# Altium project partes_proyecto.PrjPcb
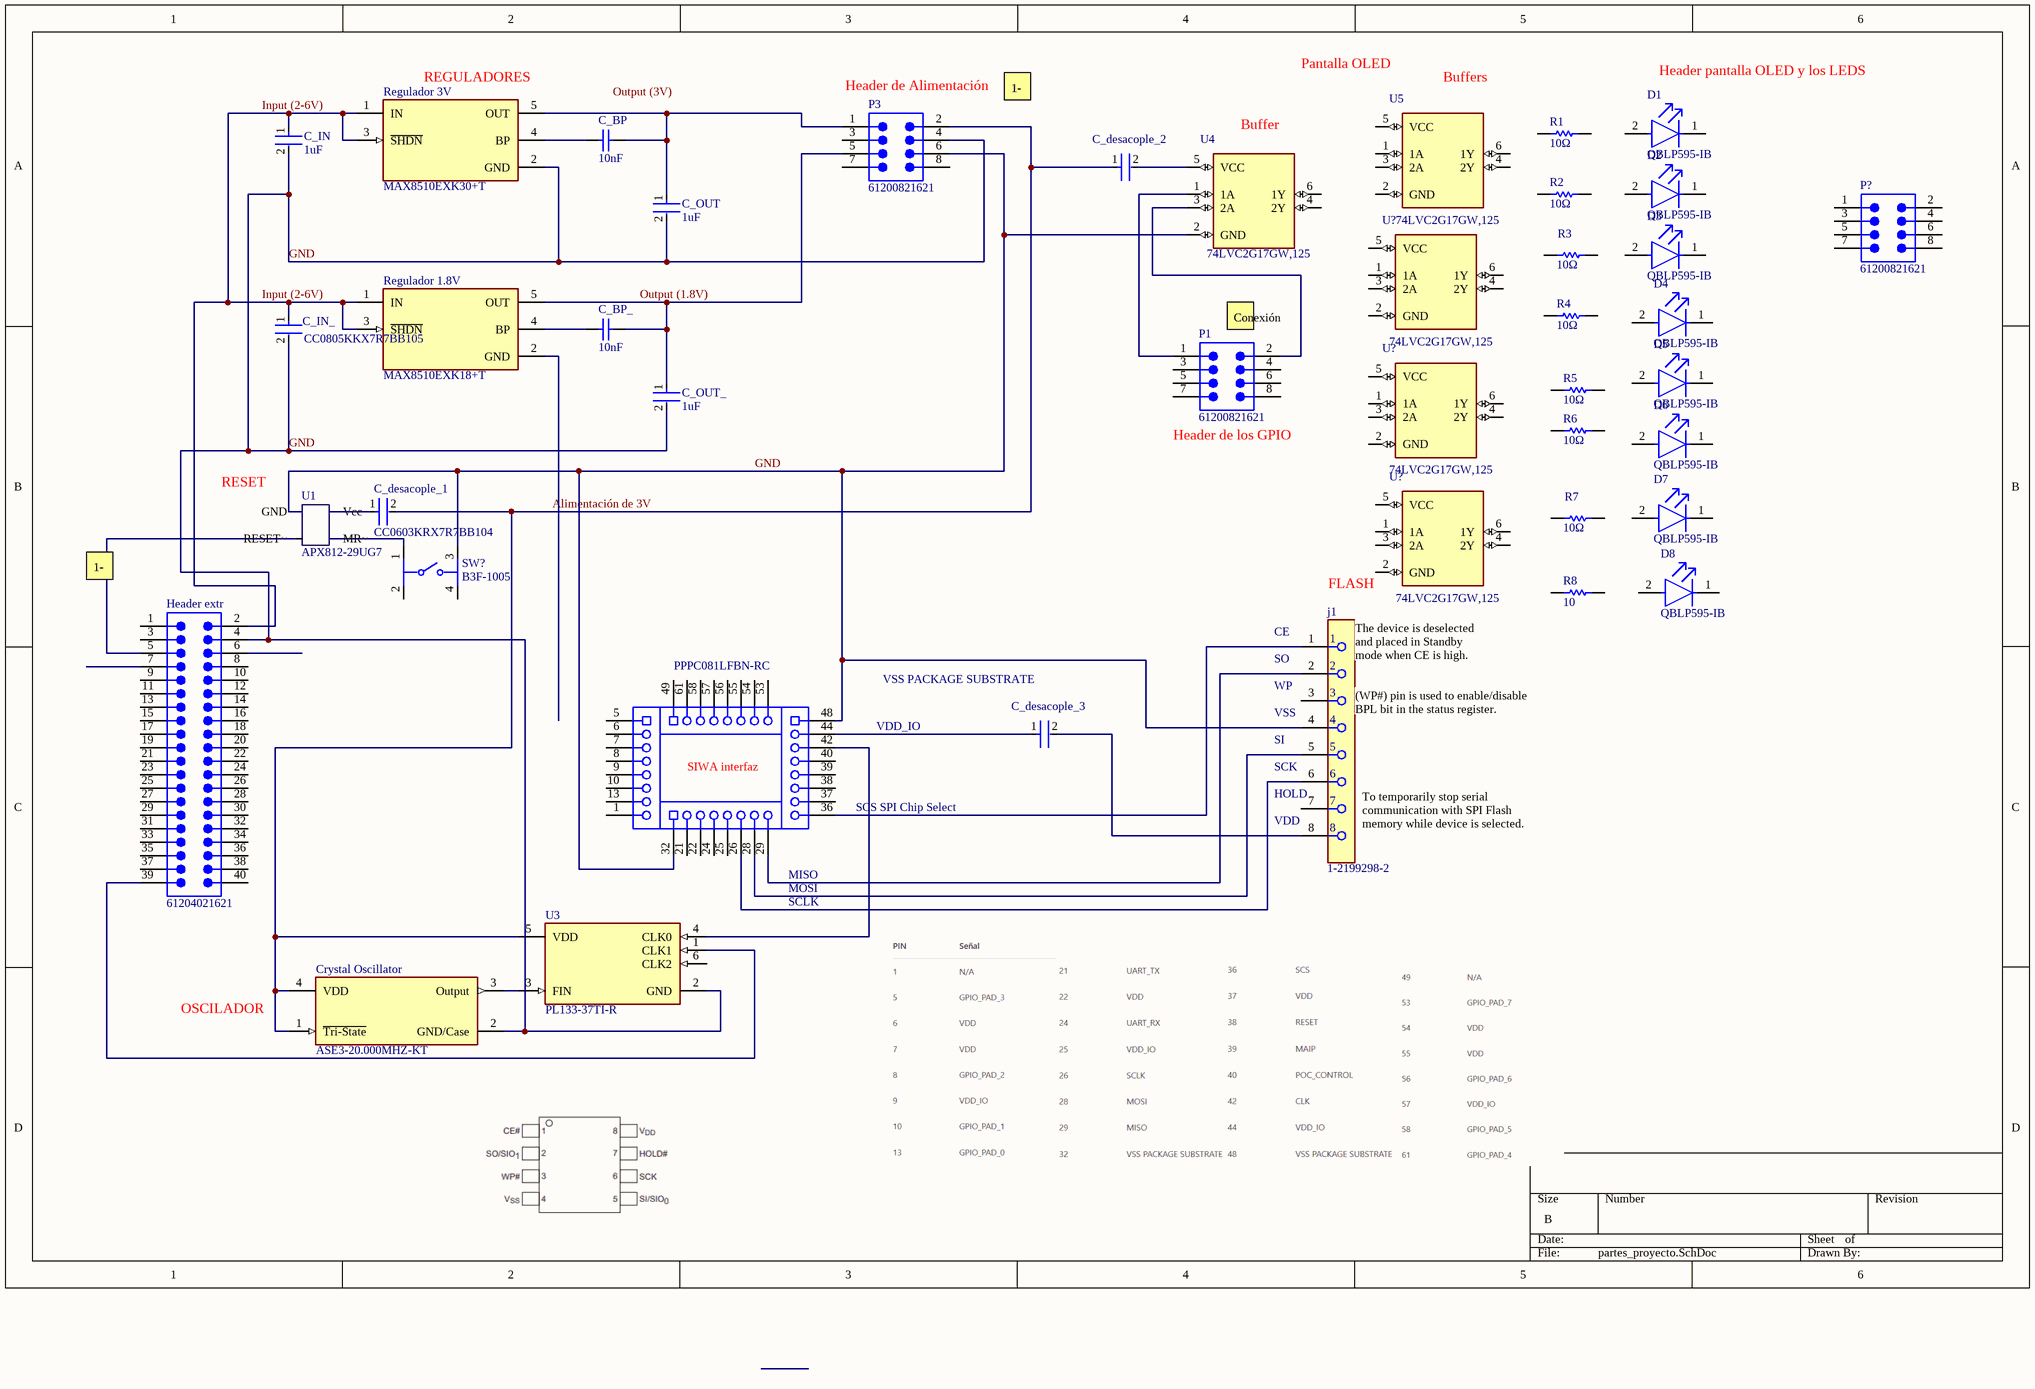
[diagram p0: partes_proyecto.SchDoc]
1 sheet, 45 parts. Net scope: global (net labels, ports and power ports of the same name join across sheets).

## Sheet partes_proyecto.SchDoc
size B; SheetNumber: 1; SheetTotal: 1

### Parts
(Parts that share a designator on the sheet are numbered #1, #2 ... from top to bottom, then left to right.)
C_BP  10nF  [CAPC2013X100X50NL20T25]
C_BP_  10nF  [CAPC2013X100X50NL20T25]
C_desacople_1  CC0603KRX7R7BB104  [FP-CC0603-DA-MFG]
C_desacople_2  CC0603KRX7R7BB104  [FP-CC0603-DA-MFG]  (value not drawn)
C_desacople_3  CC0603KRX7R7BB104  [FP-CC0603-DA-MFG]  (value not drawn)
C_IN  1uF  [FP-CC0805-0_85-MFG]
C_IN_  CC0805KKX7R7BB105  [FP-CC0805-0_85-MFG]
C_OUT  1uF  [FP-CC0805-0_85-MFG]
C_OUT_  1uF  [FP-CC0805-0_85-MFG]
Crystal_Oscillator  ASE3-20.000MHZ-KT  [FP-ASE3-MFG]
D1  QBLP595-IB  [FP-QBLP595-IB-MFG]
D2  QBLP595-IB  [FP-QBLP595-IB-MFG]
D3  QBLP595-IB  [FP-QBLP595-IB-MFG]
D4  QBLP595-IB  [FP-QBLP595-IB-MFG]
D5  QBLP595-IB  [FP-QBLP595-IB-MFG]
D6  QBLP595-IB  [FP-QBLP595-IB-MFG]
D7  QBLP595-IB  [FP-QBLP595-IB-MFG]
D8  QBLP595-IB  [FP-QBLP595-IB-MFG]
Header_extr  61204021621  [61204021621]
j1  1-2199298-2  [FP-1-2199298-2-MFG]
P1  61200821621  [61200821621]
P3  61200821621  [61200821621]
P?  61200821621  [61200821621]
R1  value 10Ω  (hidden comment: Resistor)
R2  value 10Ω  (hidden comment: Resistor)
R3  value 10Ω  (hidden comment: Resistor)
R4  value 10Ω  (hidden comment: Resistor)
R5  value 10Ω  (hidden comment: Resistor)
R6  value 10Ω  (hidden comment: Resistor)
R7  value 10Ω  (hidden comment: Resistor)
R8  value 10  (hidden comment: Resistor)
Regulador_1.8V  MAX8510EXK18+T  [FP-X5-1-MFG]
Regulador_3V  MAX8510EXK30+T  [FP-X5-1-MFG]
siwa1  PPPC081LFBN-RC  [SLIN-PPPC081LFBN-RC_V]  (value not drawn)
siwa2  PPPC081LFBN-RC  [SLIN-PPPC081LFBN-RC_V]  (value not drawn)
siwa3  PPPC081LFBN-RC  [SLIN-PPPC081LFBN-RC_V]  (value not drawn)
siwa4  PPPC081LFBN-RC  [SLIN-PPPC081LFBN-RC_V]  (value not drawn)
SW?  B3F-1005  [FP-B3F-1005-MFG]
U1  APX812-29UG7  [APX812-29UG7]
U3  PL133-37TI-R  [FP-SOT23-6LD-PL-1-IPC_A]
U4  74LVC2G17GW,125  [SOT363_INFINEON]
U5  74LVC2G17GW,125  [SOT363_INFINEON]
U?#1  74LVC2G17GW,125  [SOT363_INFINEON]
U?#2  74LVC2G17GW,125  [SOT363_INFINEON]
U?#3  74LVC2G17GW,125  [SOT363_INFINEON]

### Nets
Alimentación de 3V: C_desacople_1.2 C_desacople_2.1 Crystal_Oscillator.1(~{Tri-State}) Crystal_Oscillator.4(VDD) P3.2 U3.5(VDD)
GND: C_IN.2 C_IN_.2 C_OUT.2 C_OUT_.2 Crystal_Oscillator.2(GND/Case) Header_extr.4 j1.4 P3.4 P3.6 Regulador_3V.2(GND) siwa3.48 siwa4.32 SW?.3 U1.GND U3.2(GND) U4.2(GND)
Input (2-6V): C_IN.1 C_IN_.1 Header_extr.2 Regulador_1.8V.1(IN) Regulador_1.8V.3(~{SHDN}) Regulador_3V.1(IN) Regulador_3V.3(~{SHDN})
Output (1.8V): C_BP_.2 C_OUT_.1 P3.5 Regulador_1.8V.5(OUT)
NetC_BP_1: C_BP.1 Regulador_3V.4(BP)
NetC_BP_2: C_BP.2 C_OUT.1 P3.1 Regulador_3V.5(OUT)
NetC_BP__1: C_BP_.1 Regulador_1.8V.4(BP)
NetC_desacople_1_1: C_desacople_1.1 U1.0(Vcc)
NetC_desacople_2_2: C_desacople_2.2 U4.5(VCC)
NetC_desacople_3_1: C_desacople_3.1 siwa3.44
NetC_desacople_3_2: C_desacople_3.2 j1.8
NetCrystal_Oscillator_3: Crystal_Oscillator.3(Output) U3.3(FIN)
NetHeader_extr_39: Header_extr.39 U3.1(CLK1)
Netj1_1: j1.1 siwa3.36
Netj1_2: j1.2 siwa4.29
Netj1_5: j1.5 siwa4.28
Netj1_6: j1.6 siwa4.26
NetP1_1: P1.1 U4.1(1A)
NetP1_2: P1.2 U4.3(2A)
Netsiwa3_42: siwa3.42 U3.4(CLK0)
NetSW?_1: SW?.1 U1.3(MR~)

Not connected (* = marked no-connect by the designer): D1 1(C) 2(A); D2 1(C) 2(A); D3 1(C) 2(A); D4 1(C) 2(A); D5 1(C) 2(A); D6 1(C) 2(A); D7 1(C) 2(A); D8 1(C) 2(A); Header_extr 1 3 5 6 7 8 9 10 11 12 13 14 15 16 17 18 19 20 21 22 23 24 25 26 27 28 29 30 31 32 33 34 35 36 37 38 40; j1 3 7; P1 3 4 5 6 7 8; P3 3 7 8; P? 1 2 3 4 5 6 7 8; R1 1 2; R2 1 2; R3 1 2; R4 1 2; R5 1 2; R6 1 2; R7 1 2; R8 1 2; Regulador_1.8V 2(GND); siwa1 1(8) 5(1) 6(2) 7(3) 8(4) 9(5) 10(6) 13(7); siwa2 49(1) 53(8) 54(7) 55(6) 56(5) 57(4) 58(3) 61(2); siwa3 37(7) 38(6) 39(5) 40(4); siwa4 21(2) 22(3) 24(4) 25(5); SW? 2 4; U1 2(RESET~); U3 6(CLK2); U4 4(2Y) 6(1Y); U5 1(1A) 2(GND) 3(2A) 4(2Y) 5(VCC) 6(1Y); U?#1 1(1A) 2(GND) 3(2A) 4(2Y) 5(VCC) 6(1Y); U?#2 1(1A) 2(GND) 3(2A) 4(2Y) 5(VCC) 6(1Y); U?#3 1(1A) 2(GND) 3(2A) 4(2Y) 5(VCC) 6(1Y)

### Notes on the sheet
- (near Regulador_3V) REGULADORES
- (near P3) Header de Alimentación
- 1- Regulador de 3V
  3- Alimentación externa de 3V
  5- Regulador de 5V
  7- Alimentación externa de 1.8V
  2- Salida de 3V
  4- Entrada de GND de los reguladores
  6- Salida de GND para el resto del circuito
  8- Salida de 1.8V
- Pantalla OLED
- (near U5) Buffers
- Header pantalla OLED y los LEDS
- (near U4) 1A- GPIO 0
  2A- GPIO 1
- (near U4) Buffer
- (near P1) Conexión de los GPIO [0-7] en los puertos, desde el [1-8]
- (near U1) RESET
- (near P1) Header de los GPIO
- 1- Alimentación externa
  3- Tierra externa
  5- Reset generado con pulsador en la PCB
  7- Reset externo
  2- Alimentación que va a reguladores
  4- Tierra que va a reguladores
  6- Salida del Reset que va a SIWA
  8-
- (near j1) CE
- FLASH
- (near siwa2) PPPC081LFBN-RC
- VSS PACKAGE SUBSTRATE
- (near j1) SO
- (near j1) WP
- (near j1) The device is deselected and placed in Standby mode when CE is high.
- SIWA interfaz
- VDD_IO
- (near j1) VSS
- (near j1) SI
- (near j1) SCK
- (near j1) (WP#) pin is used to enable/disable BPL bit in the status register.
- (near siwa3) SCS SPI Chip Select
- (near j1) HOLD
- (near j1) VDD
- (near j1) To temporarily stop serial communication with SPI Flash memory while device is selected.
- MISO
- MOSI
- SCLK
- OSCILADOR
- Labels drawn without touching a wire or pin: Output (3V)

### Library data of the parts
C_BP C_BP_ = CMP-2007-03708-1: Part Number: C0805F103K5RACTU; Manufacturer: Kemet
C_desacople_1-C_desacople_3 = CMP-2000-05002-2: CAP CER 0.1UF 16V X7R 0603; Manufacturer: YAGEO; Tolerance: 0.1; Value: 100 nF; Temperature Coefficient: 15%; Voltage Rating: 16 V; Package: CC0603-DA; ComponentLink2Description: Datasheet; Octopart: https://octopart.com/cc0603krx7r7bb104-yageo-192941; Temperature Range High: +125°C; Digikey Description: CAP CER 0.1UF 16V X7R 0603; Voltage: 16 V; Device Class L2: Capacitors; Height: 0.9mm; Temperature: -55°C to +125°C; Manufacturer Part Number: CC0603KRX7R7BB104; Device Class L1: Passive Components; Device Class L3: Ceramic Capacitors; ComponentLink2URL: http://www.yageo.com/documents/recent/UPY-GPHC_X7R_6.3V-to-50V_18.pdf; Footprint Url: http://www.yageo.com/exep/pages/download/literatures/UPY-C_GEN_24.pdf; RoHS: TRUE; Temperature Range Low: -55°C; Temperature Characteristic: X7R; Lead Free: Yes; Capacitance: 100 nF; Category: Cap; Mouser Description: Multilayer Ceramic Capacitor, CC Series, 0.1 - F, - 10%, X7R, 16 V, 0603 [1608 Metric]; Material: Ceramic; Automotive: No
C_IN C_OUT C_OUT_ = CMP-03422-000001-1: CAP CER 1UF 16V X7R 0805; Manufacturer: Yageo; Manufacturer Part Number: CC0805KKX7R7BB105; Tolerance: 0.1; Voltage Rating: 16 V; Category: Cap; Capacitance: 1 uF; ComponentLink2Description: Datasheet; Automotive: No; Temperature Range High: +85°C; RoHS: TRUE; Footprint Url: http://www.yageo.com/exep/pages/download/literatures/UPY-C_GEN_24.pdf; Mouser Description: Multilayer Ceramic Capacitors MLCC - SMD/SMT 1.0uF 16V X7R 10%; Height: 0.95mm; Ipc Land Pattern Name: CAPC200125X85; Temperature: -30°C to +85°C; Lead Free: Yes; Value: 1 uF; Temperature Characteristic: X7R; Package: CC0805-0.85; Temperature Range Low: -30°C; Device Class L1: Passive Components; Device Class L3: Ceramic Capacitors; Octopart: https://octopart.com/cc0805kkx7r7bb105-yageo-8376555; Material: Ceramic; ComponentLink2URL: http://www.yageo.com/documents/recent/UPY-GPHC_Y5V_6.3V-to-50V_8.pdf; Device Class L2: Capacitors; Digikey Description: CAP CER 1UF 16V X7R 0805
C_IN_ = CMP-03422-000001-1: CAP CER 1UF 16V X7R 0805; Manufacturer: Yageo; Tolerance: 0.1; Voltage Rating: 16 V; Category: Cap; Capacitance: 1 uF; ComponentLink2Description: Datasheet; Automotive: No; Temperature Range High: +85°C; RoHS: TRUE; Footprint Url: http://www.yageo.com/exep/pages/download/literatures/UPY-C_GEN_24.pdf; Mouser Description: Multilayer Ceramic Capacitors MLCC - SMD/SMT 1.0uF 16V X7R 10%; Height: 0.95mm; Ipc Land Pattern Name: CAPC200125X85; Temperature: -30°C to +85°C; Lead Free: Yes; Value: 1 uF; Temperature Characteristic: X7R; Package: CC0805-0.85; Temperature Range Low: -30°C; Device Class L1: Passive Components; Device Class L3: Ceramic Capacitors; Octopart: https://octopart.com/cc0805kkx7r7bb105-yageo-8376555; Material: Ceramic; Manufacturer Part Number: CC0805KKX7R7BB105; ComponentLink2URL: http://www.yageo.com/documents/recent/UPY-GPHC_Y5V_6.3V-to-50V_8.pdf; Device Class L2: Capacitors; Digikey Description: CAP CER 1UF 16V X7R 0805
Crystal_Oscillator = CMP-27762-010045-1: XTAL OSC XO 20.0000MHZ CMOS SMD; Min Supply Voltage: 1.71V; Max Supply Current: 4mA; Operating Supply Voltage: 1.8V; Max Supply Voltage: 1.89V; Frequency: 20MHz; Frequency Stability: 30ppm; Load Capacitance: 15pF; Length: 3.2mm; Mount: Surface Mount; Min Operating Temperature: -10°C; Max Operating Temperature: 70°C; Series: ASE3; Height: 0.049inch; Package Quantity: 1000; Depth: 2.5mm; Case/Package: SMD/SMT; Number of Pins: 4; Lead Free: Lead Free; Width: 0.098inch; Termination: SMD/SMT; Packaging: Tape and Reel; Radiation Hardening: No
D1-D8 = CMP-113271-000002-1: LED BLUE CLEAR 0402 SMD; Lens Size: 0.5mm; Dominant Wavelength: 465nm; Forward Voltage: 3.1V; Lens Color: Colorless; Luminous Intensity: 85mcd; Test Current: 20mA; Viewing Angle: 140°; Lens Style: Flat; Width: 0.5mm; Case Code (Metric): 1005; Lens Transparency: Clear; Color: Blue; Packaging: Tape and Reel; Case Code (Imperial): 0402; Mount: Surface Mount; Length: 1mm; Case/Package: 0402; Height: 0.6mm
Header_extr = CMP-1502-00015-3: NexarPartId: 25903616; Gender: Male; Row Spacing: 2.54mm; Connector Type: Male Pin; Current Rating: 3A; Number of Positions: 40; Voltage Rating: 250V; Insulation Resistance: 1GΩ; Contact Resistance: 20mΩ; RoHS: Compliant; Color: Black; Pitch: 2.54mm; Orientation: Vertical; Contact Plating: Gold; Lead Pitch: 2.54mm; REACH SVHC: Unknown; Termination: Solder; Max Operating Temperature: 105°C; Insulation Material: PBT; Number of Rows: 2; Min Operating Temperature: -40°C; Number of Pins: 40; Mount: Through Hole; Contact Material: Copper; Number of Contacts: 40; Height: 9.25mm; Length: 58.46mm; Operating Supply Voltage: 250V
j1 = CMP-03370-000009-1: CONN IC DIP SOCKET 8POS TIN; Contact Post Length: 3inch; Number of Contacts: 8; Contact Current Rating: 1A; Contact Resistance: 20mR; Insulation Resistance: 1GR; Connector Type: Pin; Row Spacing: 0.3inch; Pitch: 2.54mm; Mating Alignment: Yes (With); RoHS Compliant: Yes; Packaging: Rail/Tube; Contact Material: Bronze; Lead Pitch: 2.54mm; Mount: Through Hole; Termination: Through Hole; Max Operating Temperature: 105°C; Flammability Rating: UL94 V-0; Package Quantity: 60; Contact Finish - Mating: TIN; ELV: Compliant; Radiation Hardening: No; Number of Rows: 2; Series: Diplomate DL; Color: Black; Number of Positions: 8; Contact Plating: Tin; Min Operating Temperature: -40°C; Lead Free: Lead Free; Length: 0.4inch; Orientation: Straight; Housing Material: PBT
P1 P3 P? = CMP-1502-00006-2: NexarPartId: 32855460; Gender: Male; Row Spacing: 2.54mm; Connector Type: Male Pin; Insulation Resistance: 1GΩ; Contact Resistance: 20mΩ; Number of Positions: 8; Current Rating: 3A; Operating Supply Voltage: 250V; Orientation: Vertical; Lead Pitch: 2.54mm; Length: 17.82mm; Max Operating Temperature: 105°C; Mount: Through Hole; Color: Black; Insulation Material: PBT; RoHS: Compliant; Contact Material: Copper; Number of Contacts: 8; Pitch: 2.54mm; Contact Plating: Gold; Min Operating Temperature: -40°C; Number of Pins: 8; Termination: Solder; REACH SVHC: Unknown; Number of Rows: 2
R1-R8 = Resistor: TC1: 0; SimulationGenericComponent: True; TC2: 0
Regulador_1.8V = CMP-0246-00401-2: IC REG LINEAR 1.8V 120MA SC70-5; Accuracy: 2%; Number of Outputs: 1; Min Current Limit: 130mA; Max Input Voltage: 6V; Max Power Dissipation: 247mW; Output Configuration: Positive; Output Type: Fixed; Quiescent Current: 90uA; Reference Voltage: 1.225V; Min Input Voltage: 2V; Power Supply Rejection Ratio (PSRR): 54dB; Input Bias Current: 40uA; Output Current: 120mA; Nominal Output Voltage: 1.8V; Output Voltage: 1.8V; Series: -; Number of Regulators: 1; Packaging: Tape and Reel; Mount: Surface Mount; Case/Package: SC; Lead Free: Lead Free; RoHS Compliant: Yes; Number of Pins: 5; Package Quantity: 2500; Max Output Current: 120mA; Polarity: Positive; Min Operating Temperature: -40°C; Max Operating Temperature: 85°C
Regulador_3V = CMP-0246-00520-2: IC REG LINEAR 3V 120MA SC70-5; Output Configuration: Positive; Dropout Voltage: 120mV; Min Current Limit: 130mA; Number of Outputs: 1; Max Input Voltage: 6V; Power Supply Rejection Ratio (PSRR): 54dB; Reference Voltage: 1.225V; Min Input Voltage: 2V; Max Power Dissipation: 247mW; Accuracy: 2%; Input Bias Current: 40uA; Output Type: Fixed; Quiescent Current: 90uA; Output Current: 120mA; Nominal Output Voltage: 3V; Max Output Current: 120mA; Package Quantity: 2500; Polarity: Positive; Number of Pins: 5; RoHS Compliant: Yes; Output Voltage: 3V; Mount: Surface Mount; Lead Free: Lead Free; Case/Package: SC; Number of Regulators: 1; Packaging: Tape and Reel; Series: -; Min Operating Temperature: -40°C; Radiation Hardening: No; Max Operating Temperature: 85°C
siwa1-siwa4 = CMP-1770-00002-1: Female Header, Pitch 2.54 mm, 1 x 8 Position, Height 8.5 mm, Tail Length 3.2 mm, -40 to 105 degC, RoHS, Bulk; Case\Package: TO-252-3; Rds On Max: 115 mohm; Typical Rise Time: 90 ns; Max Power Dissipation: 2.5 W; Input Capacitance: 350 pF; Elements: 1; Height: 2.39 mm; Min Operating Temperature: -55 degC; RoHSCompliant: true; PackageDescription: Female Header, Pitch 2.54 mm, 1 x 8 Position, Height 8.5 mm, Tail Length 3.2 mm; Length: 6.73 mm; ComponentLink1Description: Datasheet; Package Quantity: 2500; Max Operating Temperature: 150 degC; Width: 6.22 mm; Radiation Hardening: No; Packaging: Tape and Reel; REACH SVHC: No SVHC; Pins: 3; PackageReference: PPPC081LFBN-RC; ComponentLink1URL: http://sullinscorp.com/catalogs/101_PAGE114-115_.100_FEMALE_HDR.pdf; DatasheetVersion: Jan-15; Mount: Surface Mount
SW? = CMP-08834-000043-1: SWITCH TACTILE SPST-NO 0.05A 24V; Contact Current Rating: 50mA; Switch Travel: 0.25mm; Mechanical Life: 100000Cycles; Switch Function: Off-Mom; Throw Configuration: SPST; Illumination Type: Non-Illuminated; Actuator Type: Standard; Electrical Life: 300000Cycles; Number of Poles: 1; Ratings: IP00; Actuator Color: Orange; Contact Resistance: 100mR; Operating Force: 2.55N; Actuator Length: 0.9mm; Weight: 0.25g; Max Operating Temperature: 70°C; Packaging: Bag; Depth: 6mm; Package Quantity: 1500; Lead Free: Lead Free; Voltage Rating (DC): 24V; Termination: PC Pins; Length: 6mm; Contact Material: Gold; Min Operating Temperature: -25°C; Mount: Through Hole; Max Voltage Rating (DC): 24V; Current Rating: 50mA; Max Current Rating: 50mA; Orientation: Straight; Width: 6mm; Height: 4.3mm; Series: B3F; Contact Plating: Silver
U1 = APX812-29UG7: 4-Pin Microprocessor Supervisor With Manual Reset. SOT143.
U3 = CMP-06262-000018-1: IC CLK BUFFER 1:3 150MHZ 6SOT23; Number of Circuits: 1; Input: LVCMOS; Lead Free: Lead Free; Case/Package: SOT-23-6; Min Operating Temperature: -40°C; Max Frequency: 150MHz; Series: -; RoHS Compliant: Yes; Max Operating Temperature: 85°C; Package Quantity: 3000; Mount: Surface Mount; Packaging: Cut Tape
U4 U5 U?#1-U?#3 = 74LVC2G17GW,125: Buffer, Non-Inverting 2 Element 1 Bit per Element Push-Pull Output 6-TSSOP; MF: Nexperia USA Inc.; SnapEDA_Link: https://www.snapeda.com/parts/74LVC2G17GW,125/Nexperia/view-part/?ref=snap; Package: SOT-363 Nexperia USA; Value: *; MP: 74LVC2G17GW,125; Check_prices: https://www.snapeda.com/parts/74LVC2G17GW,125/Nexperia/view-part/?ref=eda